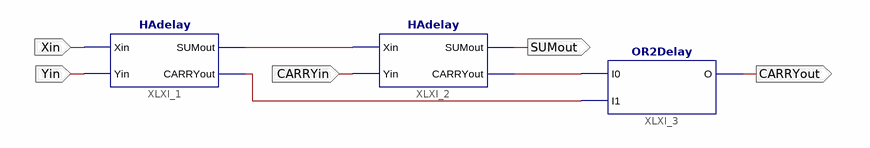
[diagram p0: schematic sheet 1]
// Xilinx ISE schematic OneBitRCA.sch (spartan6) as structural Verilog: 3 symbols, 5 ports
module OneBitRCA (
  input  Xin,
  input  Yin,
  input  CARRYin,
  output SUMout,
  output CARRYout
);

  wire XLXN_4, XLXN_5, XLXN_6;

  HAdelay XLXI_1 (.Xin(Xin), .Yin(Yin), .SUMout(XLXN_4), .CARRYout(XLXN_6));
  HAdelay XLXI_2 (.Xin(XLXN_4), .Yin(CARRYin), .SUMout(SUMout), .CARRYout(XLXN_5));
  OR2Delay XLXI_3 (.I0(XLXN_5), .I1(XLXN_6), .O(CARRYout));
endmodule
